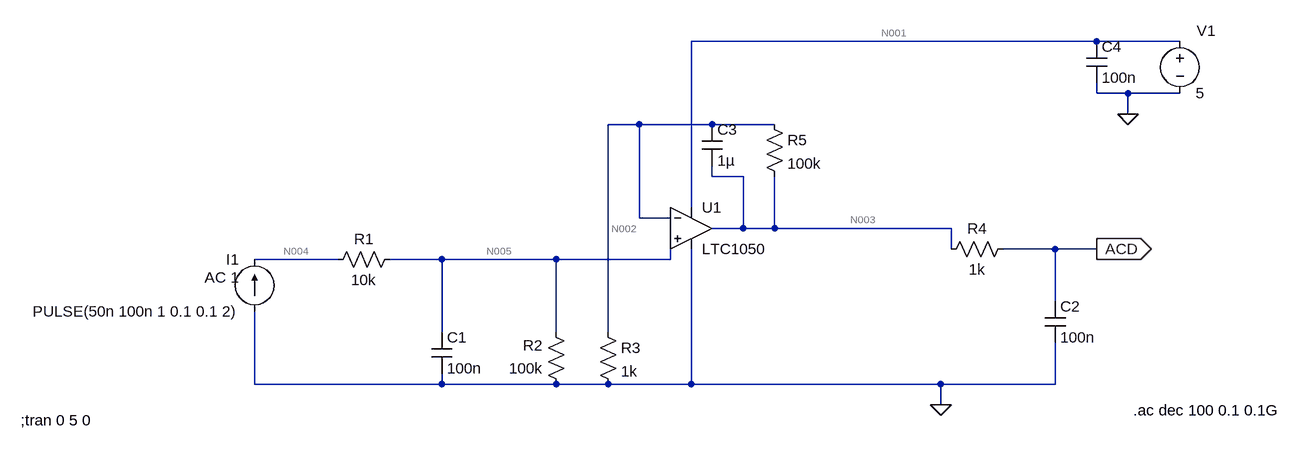
[diagram p0: schematic Draft2.asc]
Draft2.asc, the LTspice schematic file:
Version 4
SHEET 1 1160 680
WIRE 512 -400 -112 -400
WIRE 640 -400 512 -400
WIRE 512 -320 512 -336
WIRE 560 -320 512 -320
WIRE 640 -320 560 -320
WIRE 560 -288 560 -320
WIRE -192 -272 -240 -272
WIRE -80 -272 -192 -272
WIRE 16 -272 -80 -272
WIRE -80 -192 -80 -208
WIRE -32 -192 -80 -192
WIRE -112 -144 -112 -400
WIRE -192 -128 -192 -272
WIRE -144 -128 -192 -128
WIRE -32 -112 -32 -192
WIRE -32 -112 -80 -112
WIRE 16 -112 16 -192
WIRE 16 -112 -32 -112
WIRE 288 -112 16 -112
WIRE 288 -80 288 -112
WIRE 448 -80 368 -80
WIRE 512 -80 448 -80
WIRE -656 -64 -784 -64
WIRE -496 -64 -576 -64
WIRE -320 -64 -496 -64
WIRE -144 -64 -144 -96
WIRE -144 -64 -320 -64
WIRE 448 0 448 -80
WIRE -496 48 -496 -64
WIRE -320 48 -320 -64
WIRE -240 48 -240 -272
WIRE -784 128 -784 16
WIRE -496 128 -496 112
WIRE -496 128 -784 128
WIRE -320 128 -496 128
WIRE -240 128 -320 128
WIRE -112 128 -112 -80
WIRE -112 128 -240 128
WIRE 272 128 -112 128
WIRE 448 128 448 64
WIRE 448 128 272 128
WIRE 272 160 272 128
FLAG 272 160 0
FLAG 560 -288 0
FLAG 512 -80 ACD
IOPIN 512 -80 Out
SYMBOL res -560 -80 R90
WINDOW 0 0 56 VBottom 2
WINDOW 3 32 56 VTop 2
SYMATTR InstName R1
SYMATTR Value 10k
SYMBOL res -304 144 R180
WINDOW 0 36 76 Left 2
WINDOW 3 36 40 Left 2
SYMATTR InstName R2
SYMATTR Value 100k
SYMBOL res 272 -64 R270
WINDOW 0 32 56 VTop 2
WINDOW 3 0 56 VBottom 2
SYMATTR InstName R4
SYMATTR Value 1k
SYMBOL res 0 -288 R0
SYMATTR InstName R5
SYMATTR Value 100k
SYMBOL cap -512 48 R0
SYMATTR InstName C1
SYMATTR Value 100n
SYMBOL cap 432 0 R0
SYMATTR InstName C2
SYMATTR Value 100n
SYMBOL cap -96 -272 R0
SYMATTR InstName C3
SYMATTR Value 1µ
SYMBOL OpAmps\\LTC1050 -112 -176 R0
SYMATTR InstName U1
SYMBOL res -256 32 R0
SYMATTR InstName R3
SYMATTR Value 1k
SYMBOL voltage 640 -416 R0
WINDOW 0 26 0 Left 2
WINDOW 123 0 0 Left 0
WINDOW 39 0 0 Left 0
SYMATTR InstName V1
SYMATTR Value 5
SYMBOL cap 496 -400 R0
SYMATTR InstName C4
SYMATTR Value 100n
SYMBOL current -784 16 R180
WINDOW 0 24 80 Left 2
WINDOW 3 24 0 Left 2
WINDOW 123 24 52 Left 2
WINDOW 39 0 0 Left 0
SYMATTR InstName I1
SYMATTR Value PULSE(50n 100n 1 0.1 0.1 2)
SYMATTR Value2 AC 1
TEXT -1144 184 Left 2 !;tran 0 5 0
TEXT 568 168 Left 2 !.ac dec 100 0.1 0.1G

The netlist it stands for:
* Draft2.asc
R1 N005 N004 10k
R2 0 N005 100k
R4 N003 ACD 1k
R5 N002 N003 100k
C1 N005 0 100n
C2 ACD 0 100n
C3 N002 N003 1µ
XU1 N005 N002 N001 0 N003 LTC1050  ; pins In+ In- V+ V- OUT
R3 N002 0 1k
V1 N001 0 5
C4 N001 0 100n
I1 0 N004 PULSE(50n 100n 1 0.1 0.1 2) AC 1
;tran 0 5 0
.ac dec 100 0.1 0.1G
.lib LTC.lib
.backanno
.end

* Results of the author's LTspice run, read from the files saved beside the schematic
* Operating Point, zero values left out:
*   V(n005) = 5 mV
*   V(n004) = 5.5 mV
*   V(n003) = 505 mV
*   V(acd) = 505 mV
*   V(n002) = 5 mV
*   V(n001) = 5 V
*   I(I1) = 50 nA
*   I(R3) = 5 µA
*   I(R5) = -5 µA
*   I(R2) = -50 nA
*   I(R1) = -50 nA
*   I(V1) = -754.1 µA
*   Ix(u1:3) = 754.1 µA
*   Ix(u1:4) = -749.1 µA
*   Ix(u1:5) = -5 µA
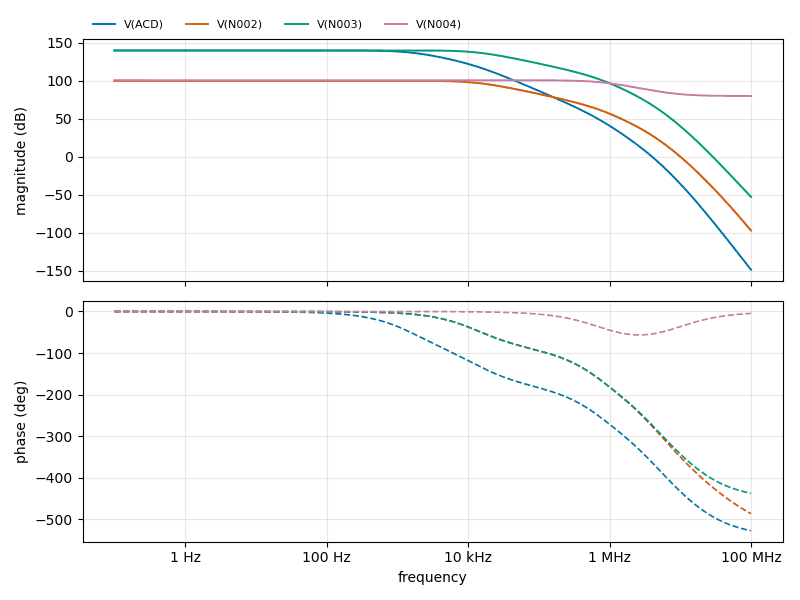
[diagram p1: AC Analysis of Draft2.asc, plotted from the saved traces]
* AC Analysis, 1 run:
*   V(ACD): 140.09 dB at 100 mHz, -148.74 dB at 100 MHz, peak 140.09 dB at 100 mHz, 3 dB below the peak at 1.6 kHz
*   V(N002): 100.00 dB at 100 mHz, -97.18 dB at 100 MHz, peak 100.03 dB at 1.318 kHz, 3 dB below the peak at 14.16 kHz
*   V(N003): 140.09 dB at 100 mHz, -52.78 dB at 100 MHz, peak 140.11 dB at 1.318 kHz, 3 dB below the peak at 14.16 kHz
*   V(N004): 100.83 dB at 100 mHz, 80.08 dB at 100 MHz, peak 100.83 dB at 100 mHz, 3 dB below the peak at 802.1 kHz